# EAGLE design mkrzero_RGBLEDmatrixPanel (EAGLE 7.3.0)
DOC_NAME: MKR Shield, RGB Matrix Adaptor; REVISION: A
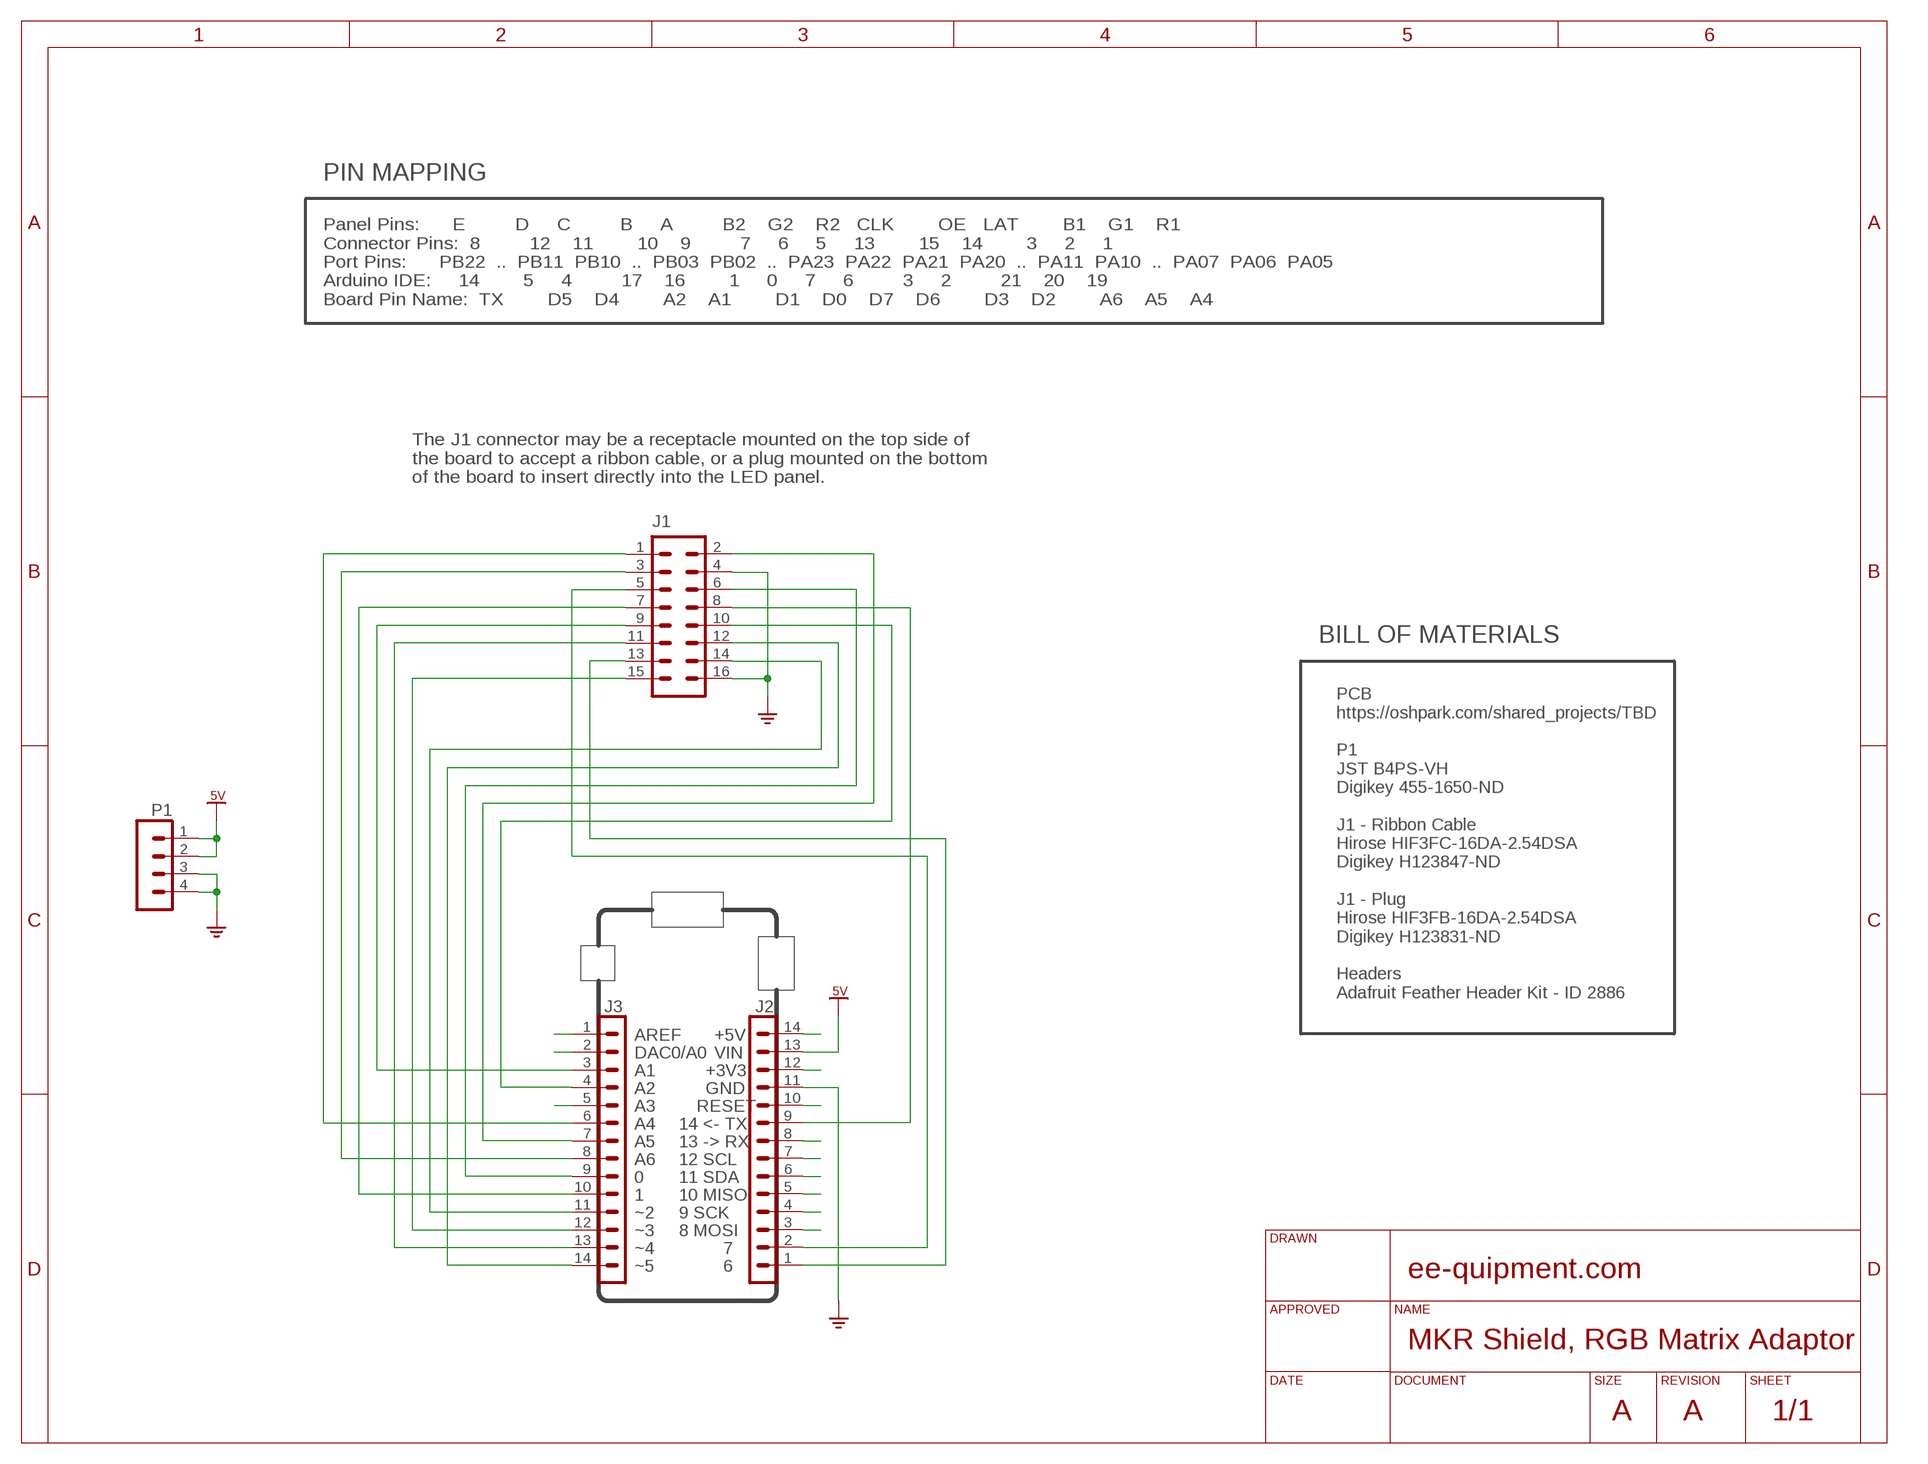
[diagram p0: schematic, sheet 1]

## Parts
J1  HDR_16  [HDR_16]
J2  DNP  STRIP-14  [STRIP-14-MODULI-A11]
J3  DNP  STRIP-14  [STRIP-14-MODULI-A11]
P1  JST_B4P-VHRA  [JST_B4PS-VH]

## Nets
5V: J2.13 P1.1 P1.2
+3V3: J2.12
+5V: J2.14
GND: J1.4 J1.16 J2.11 P1.3 P1.4
PA02_AIN0: J3.2
PA03_VREFA: J3.1
PA04_AIN4: J3.5
PA05_AIN5: J1.1 J3.6
PA06_AIN6: J1.2 J3.7
PA07_AIN7: J1.3 J3.8
PA08_S0_I2C_SDA: J2.6
PA09_S0_I2C_SCL: J2.7
PA10_TCC0-W2: J1.14 J3.11
PA11_TCC0-W3: J1.15 J3.12
PA16_S1_MOSI: J2.3
PA17_S1_SCK: J2.4
PA19_S1_MISO: J2.5
PA20_TCC0-W6: J1.13 J2.1
PA21_TCC0-W7: J1.5 J2.2
PA22_TC4-W0: J1.6 J3.9
PA23_TC4-W1: J1.7 J3.10
PB02_AIN10: J1.9 J3.3
PB03_AIN11: J1.10 J3.4
PB10_TCC0-W4: J1.11 J3.13
PB11_TCC0-W5: J1.12 J3.14
PB22_S5_TX: J1.8 J2.9
PB23_S5_RX: J2.8
RESET#: J2.10

## Notes on the sheet
- PIN MAPPING
- Panel Pins:      E         D     C         B     A         B2    G2    R2   CLK        OE   LAT        B1    G1    R1
  Connector Pins:  8         12    11        10    9         7     6     5     13        15    14        3     2     1
  Port Pins:      PB22  ..  PB11  PB10  ..  PB03  PB02  ..  PA23  PA22  PA21  PA20  ..  PA11  PA10  ..  PA07  PA06  PA05
  Arduino IDE:     14        5     4         17    16        1     0     7     6         3     2         21    20    19
  Board Pin Name:  TX        D5    D4        A2    A1        D1    D0    D7    D6        D3    D2        A6    A5    A4
- The J1 connector may be a receptacle mounted on the top side of
  the board to accept a ribbon cable, or a plug mounted on the bottom
  of the board to insert directly into the LED panel.
- BILL OF MATERIALS
- PCB
  https://oshpark.com/shared_projects/TBD
  
  P1
  JST B4PS-VH
  Digikey 455-1650-ND  
  
  J1 - Ribbon Cable
  Hirose HIF3FC-16DA-2.54DSA
  Digikey H123847-ND
  
  J1 - Plug
  Hirose HIF3FB-16DA-2.54DSA
  Digikey H123831-ND
  
  Headers
  Adafruit Feather Header Kit - ID 2886
- AREF | +5V
- DAC0/A0 | VIN
- A1 | +3V3
- A2 | GND
- A3 | RESET
- A4 | 14 <- TX
- A5 | 13 -> RX
- A6 | 12 SCL
- 0 | 11 SDA
- 1 | 10 MISO
- ~2 | 9 SCK
- ~3 | 8 MOSI
- ~4 | 7
- ~5 | 6

## Library data of the parts
J1 = 0_mitchell:HDR_16
J2 J3 = MK1_Zero:STRIP-14
P1 = 0_mitchell:JST_B4P-VH: HEADER

## Net classes
0 default: width 0.203 mm, clearance 0.203 mm
1 high current: width 0.305 mm, clearance 0.305 mm

## Board
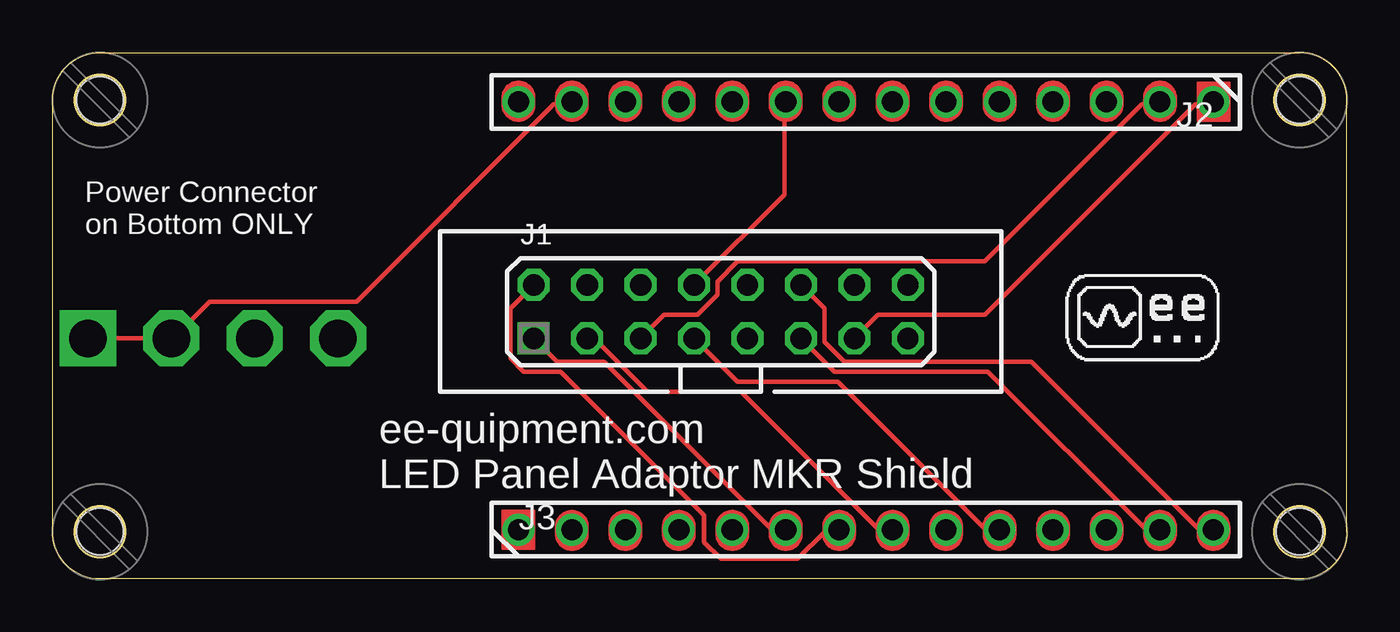
[diagram p1: board, top side]
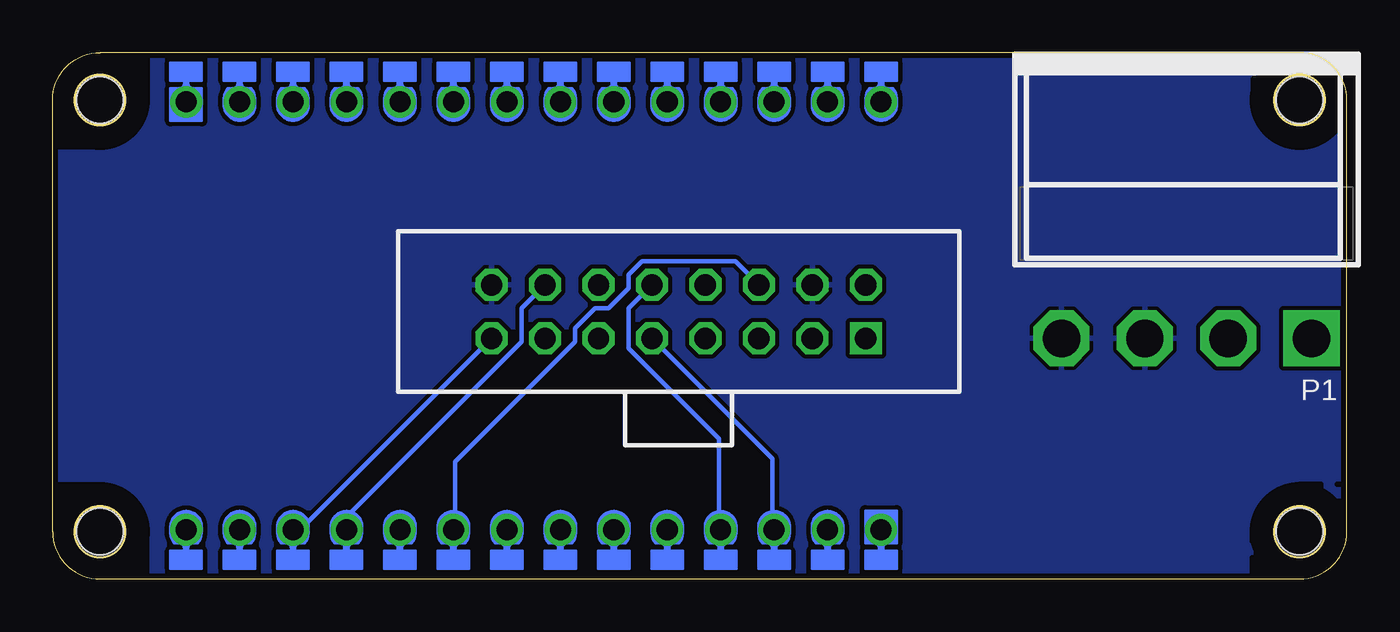
[diagram p2: board, bottom side, seen from below]

Size 61.5 x 25 mm. Coordinates in mm from the lower left corner, seen from the top.
Outline: 59.25,0 2.25,0 arc-90 0,2.25 0,22.75 arc-90 2.25,25 59.25,25 arc-90 61.5,22.75 61.5,2.25 arc-90 59.25,0
Copper layers (1*16): Top 0.0356mm / dielectric 1.5011mm / Bottom 0.0356mm
Design rules "gold_phoenix_2_layer": minimum track width 7mil, minimum drill 15mil, track to track 7mil, track to pad 7mil, pad to pad 7mil, via to via 7mil, smd to smd 7mil, copper to edge 10mil, drill to drill 16mil, minimum pad ring 10mil, minimum via ring 8mil, stop-mask expansion 2mil, vias tented up to drill 20mil, thermal gap 7mil
Holes 2.2 mm at 2.25,2.25 59.25,2.25 59.25,22.75 2.25,22.75
tRestrict: area 0,0 to 4.5,4.5; area 0,20.5 to 4.5,25; area 57,20.5 to 61.5,25; area 57,0 to 61.5,4.5; 13 lines
bRestrict: area 0,0 to 4.5,4.5; area 0,20.5 to 4.5,25; area 57,0 to 61.5,4.5; area 57,20.5 to 61.5,25; 12 lines

### Footprints (pad centres in the part's own frame; a part is rotated, then mirrored left to right if it is on the bottom)
HDR_16 = drill 1.016 square: 1 -8.89,-1.27 | drill 1.016 octagon: 2 -8.89,1.27; 3 -6.35,-1.27; 4 -6.35,1.27; 5 -3.81,-1.27; 6 -3.81,1.27; 7 -1.27,-1.27; 8 -1.27,1.27; 9 1.27,-1.27; 10 1.27,1.27; 11 3.81,-1.27; 12 3.81,1.27; 13 6.35,-1.27; 14 6.35,1.27; 15 8.89,-1.27; 16 8.89,1.27
STRIP-14-MODULI-A11 = drill 1: 1 0,0; 2 2.54,0; 3 5.08,0; 4 7.62,0; 5 10.16,0; 6 12.7,0; 7 15.24,0; 8 17.78,0; 9 20.32,0; 10 22.86,0; 11 25.4,0; 12 27.94,0; 13 30.48,0; 14 33.02,0
JST_B4PS-VH = drill 1.778 square: 1 -5.94,0 | drill 1.778 octagon: 2 -1.98,0; 3 1.98,0; 4 5.94,0

### Placement (x,y rotation side)
J1  31.75,12.7 0 top
J2  55.15,22.66 180 top
J3  22.13,2.34 0 top
P1  7.62,11.43 180 bottom
U$2  [EE_QUIPMENT_LOGO_128X128]  48.1,10.32 0 top
U$4  [FORMAT_A_L_EE-QUIPMENT]  -50.8,-132.08 0 top  (outside the outline)
U$5  [MH_RND_F_2.2MM_NM]  2.25,2.25 90 top
U$6  [MH_RND_F_2.2MM_NM]  2.25,22.75 90 top
U$7  [MH_RND_F_2.2MM_NM]  59.25,22.75 90 top
U$8  [MH_RND_F_2.2MM_NM]  59.25,2.25 90 top

### Tracks (layer width: path | path; a pad name or v marks a point on that pad's centre or on a via)
5V
  Top 0.203: J2.13 24.61,22.54 23.81,22.54 14.45,13.18 7.46,13.18 5.71,11.43 P1.2 P1.1
GND
  pour Bottom: 0,0 0,25 61.5,25 61.5,0
PA05_AIN5
  Top 0.203: J1.1 23.97,10.32 26.19,10.32 34.13,2.38 34.77,2.38 J3.6
PA06_AIN6
  Top 0.203: J1.2 21.75,12.86 21.75,10.48 22.38,9.84 24.13,9.84 30.96,3.02 30.96,1.75 31.75,0.95 35.4,0.95 36.67,2.22 37.31,2.22 J3.7
PA07_AIN7
  Top 0.203: J1.3 25.72,11.43 28.26,8.89 32.7,8.89 39.21,2.38 39.85,2.38 J3.8
PA10_TCC0-W2
  Bottom 0.203: J1.14 39.21,12.86 39.21,11.27 47.47,3.02 47.47,2.38 J3.11
PA11_TCC0-W3
  Bottom 0.203: J1.15 49.69,2.38 50.01,2.38 J3.12
PA20_TCC0-W6
  Top 0.203: J1.13 39.21,12.54 44.29,12.54 54.29,22.54 55.09,22.54 J2.1
PA21_TCC0-W7
  Top 0.203: J1.5 29.05,12.54 30.64,12.54 31.59,13.49 31.59,14.13 32.54,15.08 44.29,15.08 51.75,22.54 52.55,22.54 J2.2
PA22_TC4-W0
  Bottom 0.203: J1.6 29.05,15.08 33.5,15.08 34.13,14.45 34.13,13.81 35.08,12.86 35.72,12.86 36.67,11.91 36.67,11.27 42.39,5.56 42.39,2.38 J3.9
PA23_TC4-W1
  Top 0.203: J1.7 32.54,9.37 37.31,9.37 44.29,2.38 44.93,2.38 J3.10
PB02_AIN10
  Bottom 0.203: J1.9 27.3,5.71 27.3,2.38 J3.3
PB03_AIN11
  Bottom 0.203: J1.10 34.13,12.86 34.13,10.95 29.84,6.67 29.84,2.38 J3.4
PB10_TCC0-W4
  Top 0.203: J1.11 37.15,9.84 44.45,9.84 51.91,2.38 52.55,2.38 J3.13
PB11_TCC0-W5
  Top 0.203: J1.12 36.67,12.86 36.67,11.27 37.62,10.32 46.51,10.32 54.45,2.38 55.09,2.38 J3.14
PB22_S5_TX
  Top 0.203: J1.8 34.77,18.26 34.77,22.54 J2.9

### Text on the board
bStop: rev
ASSY_DRAWING_TEXT: NOTES: | (UNLESS OTHERWISE SPECIFIED) | 1. SQUARE PAD ON BOARD INDICATES PIN 1 | 2. SMT COMPONENT CENTROID FILE "_centroid.csv" | 3. SOLDER PASTE STENCIL FILE "eeXXX_.tps" | ASSEMBLY DRAWING
FAB_DRAWING_TEXT: NOTES: | (UNLESS OTHERWISE SPECIFIED) | FABRICATE TO MEET EU RoHS DIRECTIVE | MATERIAL | FR-4 Tg130 OR Tg170 GLASS EPOXY, 2 LAYERS | THICKNESS | 0.062" | COPPER | 1 0Z | FINISH | ENIG OR LEAD-FREE HASL | EDGES | ROUTE TO WITHIN +/- 0.010" OF OLN | SOLDER MASK | SMOBC, SOLDER MASK ON BARE COPPER, | BOTH SIDES, BLACK | FINISH | SCREEN USING NON-CONDUCTIVE | WHITE ENAMEL | LAYER STACKUP | GKO - ROUTING LAYER | XLN - DRILL DATA | GTO - TOP SILK | GTS - TOP STOP | GTL - TOP COPPER | GBL - BOTTOM COPPER | GBS - BOTTOM STOP | FABRICATION DRAWING
_tsilk: Power Connector / on Bottom ONLY | ee-quipment.com / LED Panel Adaptor MKR Shield